# Altium schematic sheet STM32.SchDoc
size A; SheetNumber: 4; SheetTotal: 5
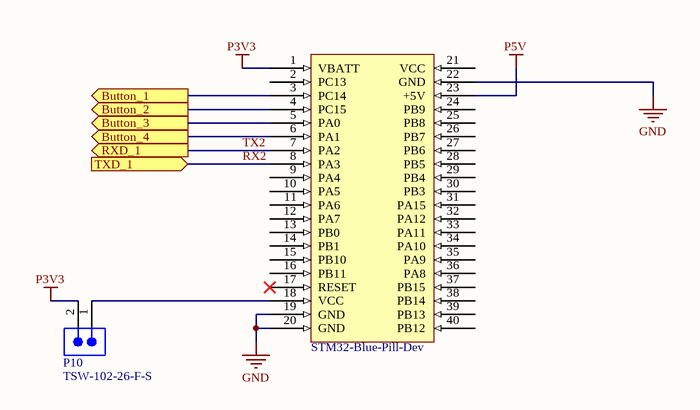
[diagram p0: STM32.SchDoc]

## Parts
*  STM32-Blue-Pill-Dev  [STM32-Blue-Pill-Dev-Headers]
P10  TSW-102-26-F-S  [SMTC-TSW-102-26-XX-S]

## Ports
Button_1 (out), Button_2 (out), Button_3 (out), Button_4 (out), RXD_1 (out), TXD_1 (in)

## Nets
GND: *.19(GND) *.20(GND) *.22(GND)
P3V3: *.1(VBATT) P10.2
P5V: *.23(+5V)
Button_1: *.3(PC14) ; port Button_1
Button_2: *.4(PC15) ; port Button_2
Button_3: *.5(PA0) ; port Button_3
Button_4: *.6(PA1) ; port Button_4
RX2: *.8(PA3) ; port TXD_1
TX2: *.7(PA2) ; port RXD_1
Net*_18: *.18(VCC) P10.1

Not connected (* = marked no-connect by the designer): * 2(PC13) 9(PA4) 10(PA5) 11(PA6) 12(PA7) 13(PB0) 14(PB1) 15(PB10) 16(PB11) 17(RESET)* 21(VCC) 24(PB9) 25(PB8) 26(PB7) 27(PB6) 28(PB5) 29(PB4) 30(PB3) 31(PA15) 32(PA12) 33(PA11) 34(PA10) 35(PA9) 36(PA8) 37(PB15) 38(PB14) 39(PB13) 40(PB12)

## Library data of the parts
P10 = CMP-002-00072-1: Headers & Wire Housings Classic PCB Header Strips, 0.100 pitch; Number of Positions: 2; Max Voltage Rating (AC): 550V; Gender: Male; Pitch: 2.54mm; Contact Post Length: 3.2mm; Voltage Rating: 500V; Max Current Rating: 7.6A; Contact Material: Bronze; Contact Gender: Male; Contact Type: -; REACH SVHC: No SVHC; Min Operating Temperature: -55°C; Housing Material: Polyester; Packaging: Bulk; Termination: Through Hole; Max Operating Temperature: 125°C; Orientation: Vertical; Flammability Rating: UL94 V-0; Package Quantity: 1; Depth: 2.54mm; Contact Plating: Gold; Number of Rows: 1; Radiation Hardening: No; Number of Contacts: 2; Length: 5.08mm; RoHS Compliant: Yes; Housing Color: Black; Weight: 0.001257oz; Contact Mating Length: 5.84mm; Series: TSW